# EAGLE design PROYECTO PCB final (EAGLE 9.5.2)
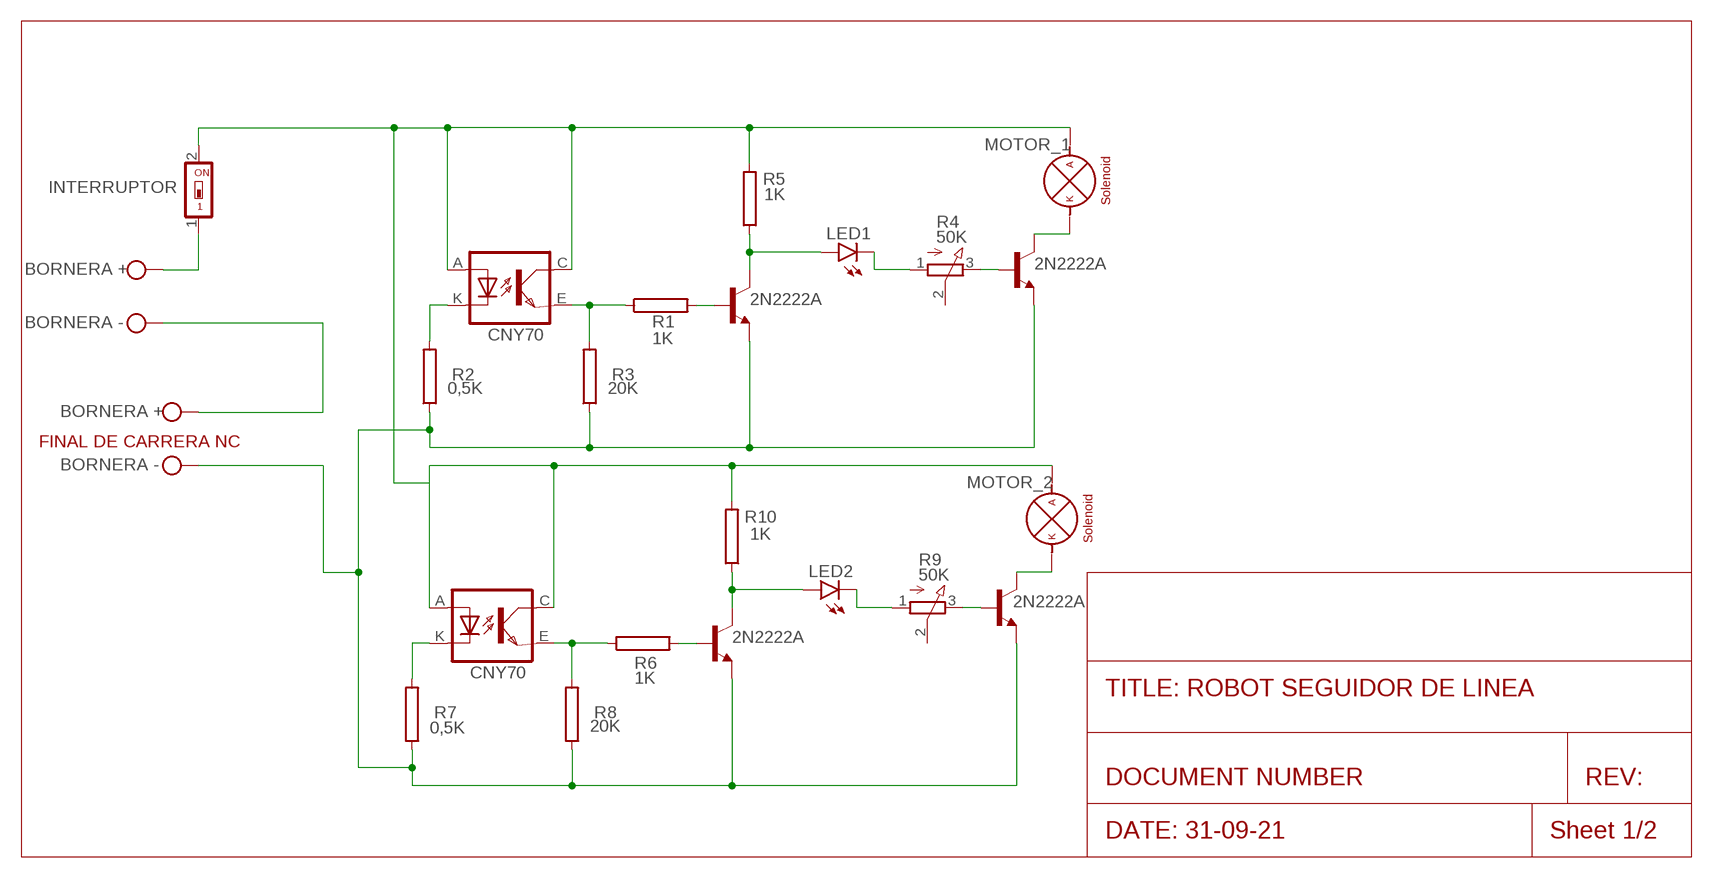
[diagram p0: schematic, sheet 1]

## Parts
BORNERA_+  AK300/2  [AK300/2]
BORNERA_+1  AK300/2  [AK300/2]
INTERRUPTOR  SWS001  [SMS-001]
LED1  TLLY4400  [LED3MM]
LED2  TLLY4400  [LED3MM]
MOTOR_1  -MOTOR  [CON2]
MOTOR_2  -MOTOR  [CON2]
Q1  2N2222A  [TO18]
Q2  2N2222A  [TO18]
Q3  2N2222A  [TO18]
Q4  2N2222A  [TO18]
R1  RMG100-V  [TO-247-2V]
R2  RMG100-V  [TO-247-2V]
R3  RMG100-V  [TO-247-2V]
R4  50K  3RP/1610N  [3RP/1610N]
R5  RMG100-V  [TO-247-2V]
R6  RMG100-V  [TO-247-2V]
R7  RMG100-V  [TO-247-2V]
R8  RMG100-V  [TO-247-2V]
R9  50K  3RP/1610N  [3RP/1610N]
R10  RMG100-V  [TO-247-2V]
U$1  CNY70  [4]
U$3  CNY70  [4]

## Nets
N$1: R2.2 U$1.K(C)
N$2: BORNERA_+.1 INTERRUPTOR.1
N$3: Q1.2(B) R1.2
N$4: R1.1 R3.2 U$1.E(EMI)
N$5: LED1.A Q1.3(C) R5.1
N$6: LED1.K(C) R4.1(A)
N$7: Q2.2(B) R4.3(E)
N$8: MOTOR_1.P$2(-) Q2.3(C)
N$11: Q3.2(B) R6.2
N$12: R6.1 R8.2 U$3.E(EMI)
N$13: R7.2 U$3.K(C)
N$14: LED2.A Q3.3(C) R10.1
N$15: LED2.K(C) R9.1(A)
N$16: Q4.2(B) R9.3(E)
N$17: MOTOR_2.P$2(-) Q4.3(C)
N$18: INTERRUPTOR.2 MOTOR_1.P$1(+) MOTOR_2.P$1(+) R5.2 R10.2 U$1.A U$1.C(COL) U$3.A U$3.C(COL)
N$19: BORNERA_+1.1 BORNERA_+.2
N$21: BORNERA_+1.2 Q1.1(E) Q2.1(E) Q3.1(E) Q4.1(E) R2.1 R3.1 R7.1 R8.1
Unconnected: R4.2(S) R9.2(S)

## Notes on the sheet
- 1K
- BORNERA +
- BORNERA -
- 1K
- 0,5K | 20K
- BORNERA +
- FINAL DE CARRERA NC
- BORNERA -
- 1K
- 1K
- TITLE: ROBOT SEGUIDOR DE LINEA
- 0,5K | 20K
- DOCUMENT NUMBER | REV:
- DATE: 31-09-21 | Sheet 1/2

## Library data of the parts
BORNERA_+ BORNERA_+1 = con-ptr500:AK300/2: CONNECTOR; OC_FARNELL: unknown; OC_NEWARK: unknown
INTERRUPTOR = smd-special:SWS001: SMD Dip Switch 1 pol.
LED1 LED2 = led:TLLY4400: Low Current (2mA) LED 3 mm Tinted Diffused Package color YELLOW Source: Data sheet <http://www.farnell.com/datasheets/391098.pdf>; MF: VISHAY SEMICONDUCTOR; OC_FARNELL: 1612439
MOTOR_1 MOTOR_2 = tango:-MOTOR
Q1-Q4 = transistor-npn:2N2222*: NPN Transistor
R1-R3 R5-R8 R10 = resistor-power:RMG100: TO-247 Power Resistor - RMG 100 Series Source: www.token.com.tw .. power-resistor-rmg100pdf; OC_FARNELL: unknown; OC_NEWARK: unknown
R4 R9 = pot:3RP/1610N: 16mm Potentiometer one level Source: http://www.alphapotentiometers.net/html/16mm_pot_2.html
U$1 U$3 = cny70:CNY70

## Board
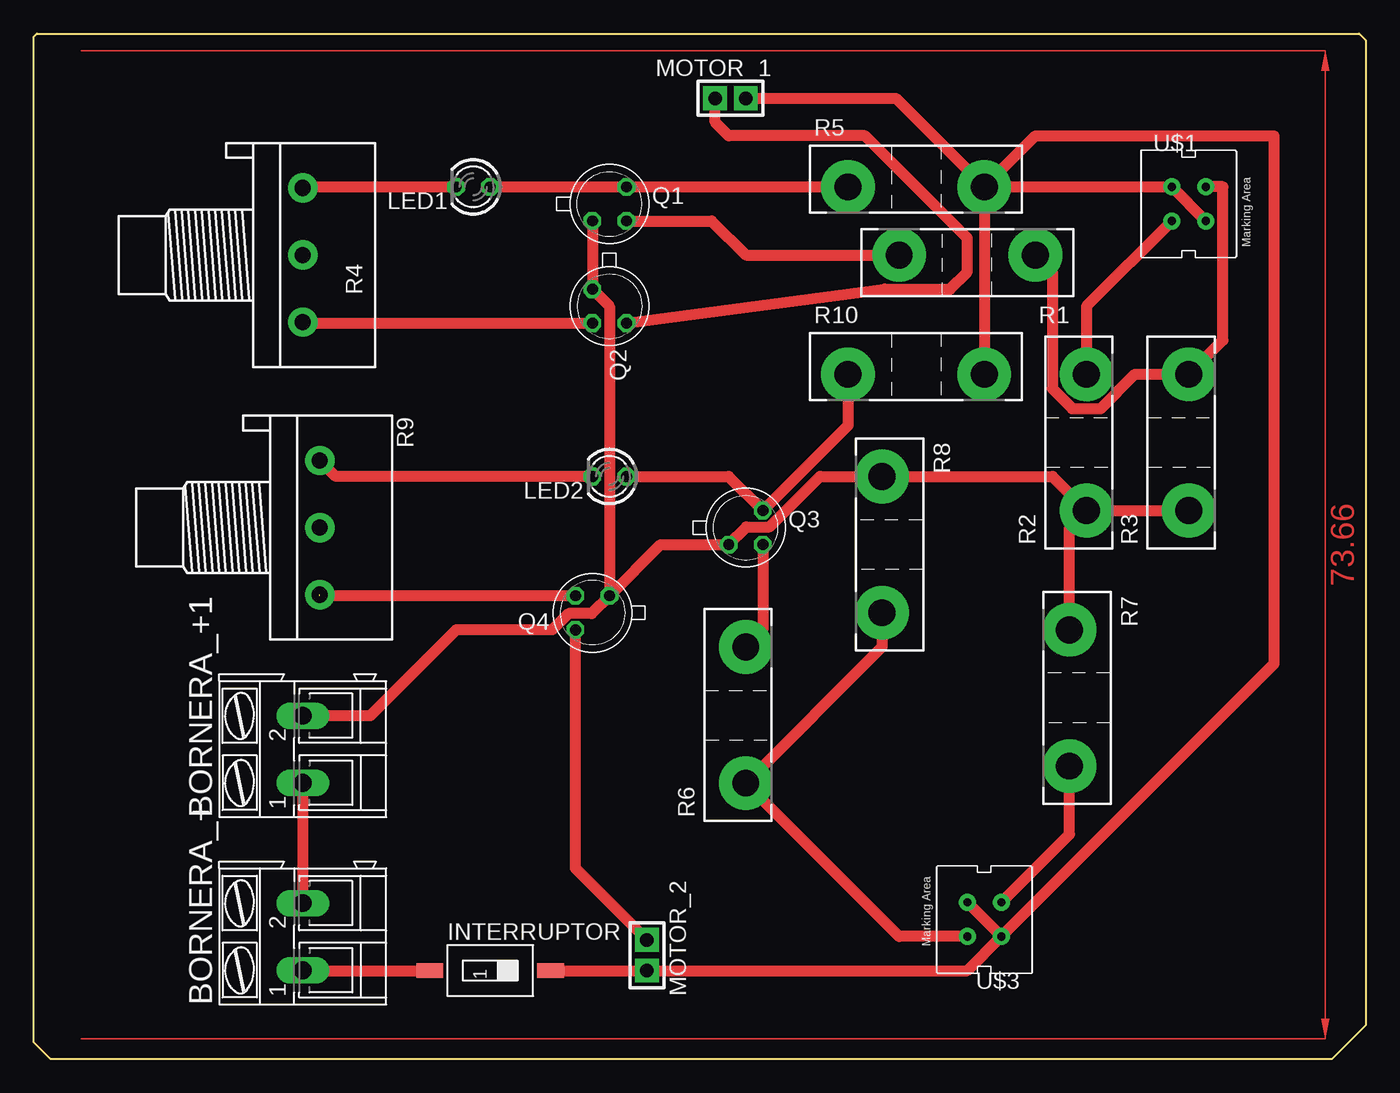
[diagram p1: board, top side]

Size 99.31 x 76.45 mm. Coordinates in mm from the lower left corner, seen from the top.
Outline: 0.25,76.45 98.81,76.45 99.31,75.95 99.31,2.54 96.77,0 1.27,0 0,1.27 0,76.2 0.25,76.45
Copper layers (1*16): Top 0.035mm / dielectric 1.5mm / Bottom 0.035mm
Design rules "default": minimum track width 6mil, minimum drill 0.35mm, track to track 6mil, track to pad 6mil, pad to pad 6mil, via to via 6mil, smd to smd 6mil, copper to edge 40mil, drill to drill 6mil, minimum pad ring 10mil, minimum via ring 8mil, stop-mask expansion 4mil, vias tented up to drill 0mil, thermal gap 10mil

### Footprints (pad centres in the part's own frame; a part is rotated, then mirrored left to right if it is on the bottom)
AK300/2 = drill 1.321 long: 1 -2.515,0; 2 2.489,0
SMS-001 = smd 1.092 x 2.007: 1 0,-4.496; 2 0,4.496
LED3MM = drill 0.813 octagon: A -1.27,0; K 1.27,0
CON2 = drill 1 pad 1.778 square: P$1 -1.27,-0.254; P$2 1.016,-0.254
TO18 = drill 0.813 octagon: 1 -1.27,-1.27; 2 1.27,-1.27; 3 1.27,1.27
TO-247-2V = drill 2 pad 4: 1 -5.08,0; 2 5.08,0
3RP/1610N = drill 1.2 pad 2.184: 1 -5,0; 2 0,0; 3 5,0
4 = drill 0.61 pad 1.27: A -1.27,1.27; C 1.27,-1.27; E 1.27,1.27; K -1.27,-1.27

### Placement (x,y rotation side)
BORNERA_+  20.07,9.14 90 top
BORNERA_+1  20.07,23.11 90 top
INTERRUPTOR  34.04,6.6 270 top
LED1  32.77,65.02 180 top
LED2  42.93,43.43 180 top
MOTOR_1  51.82,71.37 180 top
MOTOR_2  45.47,7.87 90 top
Q1  42.93,63.75 0 top
Q2  42.93,56.13 270 top
Q3  53.09,39.62 0 top
Q4  41.66,33.27 180 top
R1  69.6,59.94 180 top
R2  78.49,45.97 90 top
R3  86.11,45.97 90 top
R4  20.07,59.94 270 top
R5  65.79,65.02 0 top
R6  53.09,25.65 90 top
R7  77.22,26.92 270 top
R8  63.25,38.35 270 top
R9  21.34,39.62 270 top
R10  65.79,51.05 0 top
U$1  86.11,63.75 0 top
U$3  70.87,10.41 180 top

### Tracks (layer width: path | path; a pad name or v marks a point on that pad's centre or on a via)
N$1
  Top 0.813: U$1.K 78.49,56.13 R2.2
N$2
  Top 0.813: BORNERA_+.1 20.09,6.6 INTERRUPTOR.1
N$3
  Top 0.813: Q1.2 50.55,62.48 53.09,59.94 R1.2
N$4
  Top 0.813: R1.1 75.93,58.69 75.93,49.99 77.43,48.5 79.55,48.5 82.11,51.05 R3.2 88.65,53.59 88.65,65.02 U$1.E
N$5
  Top 0.813: LED1.A Q1.3 R5.1
N$6
  Top 0.813: R4.1 20.15,65.02 LED1.K
N$7
  Top 0.813: R4.3 20.15,54.86 Q2.2
N$8
  Top 0.813: Q2.3 63.44,57.4 63.46,57.38 68.31,57.38 69.6,58.67 69.6,61.21 61.98,68.83 51.82,68.83 50.8,69.85 MOTOR_1.P$2
N$11
  Top 0.813: Q3.2 54.36,32 R6.2
N$12
  Top 0.813: R8.2 63.25,30.73 R6.1 64.52,9.14 U$3.E
N$13
  Top 0.813: U$3.K 77.22,16.76 R7.2
N$14
  Top 0.813: LED2.A 51.82,43.43 Q3.3 60.71,47.24 R10.1
N$15
  Top 0.813: LED2.K 22.53,43.43 R9.1
N$16  (1 unrouted)
  Top 0.813: Q4.2 21.34,34.54
N$17
  Top 0.813: MOTOR_2.P$2 40.39,14.22 Q4.3
N$18
  Top 0.813: MOTOR_1.P$1 64.26,71.63 R5.2 | INTERRUPTOR.2 MOTOR_2.P$1 69.6,6.6 U$3.A | U$3.A U$3.C | U$1.C U$1.A R5.2 | R5.2 74.68,68.83 92.46,68.83 92.46,29.46 U$3.A | R5.2 R10.2
N$19
  Top 0.813: BORNERA_+1.1 BORNERA_+.2
N$21
  Top 0.813: Q1.1 Q2.1 42.93,56.13 Q4.1 | Q4.1 46.74,38.35 Q3.1 53.14,39.67 54.86,39.67 58.62,43.43 R8.1 75.95,43.43 R2.1 | Q4.1 41.61,33.22 39.88,33.22 38.66,32 31.5,32 25.09,25.6 BORNERA_+1.2 | R7.1 77.22,39.62 R2.1 | R2.1 R3.1
(copper drawn outside any net)
  shapes: Top area x1